# Altium project 1812A_Ticketing.PrjPcb
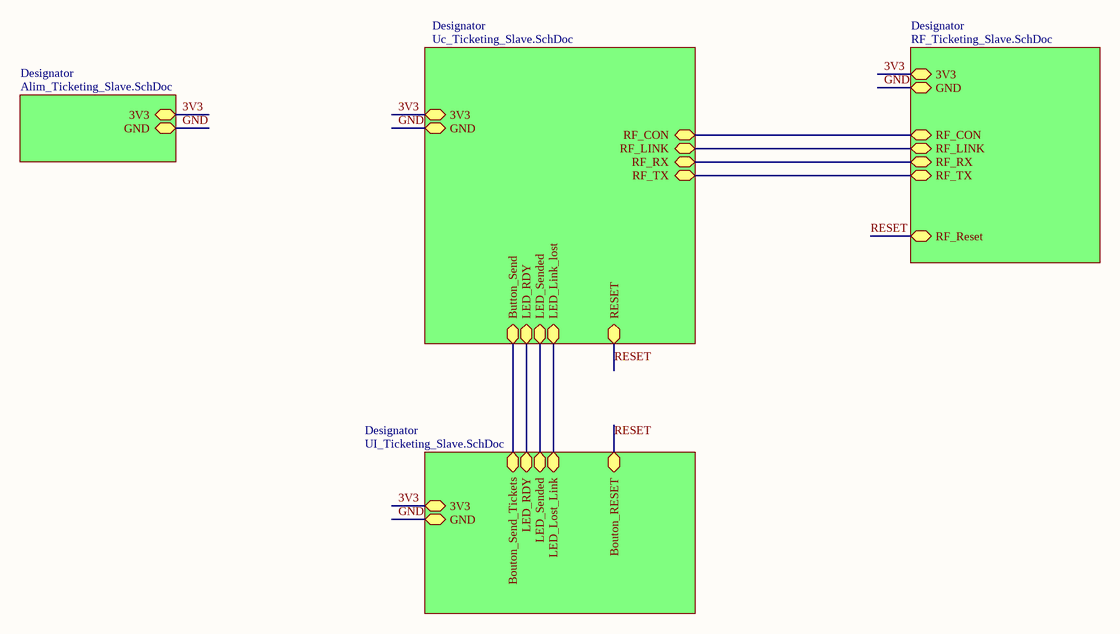
[diagram p0: Ticketing_Slave.SchDoc]
5 sheets, 34 parts. Net scope: hierarchical (ports join the sheet entries above them; power ports are global).
Sheets:
  Ticketing_Slave.SchDoc
    Designator = Uc_Ticketing_Slave.SchDoc
    Designator = RF_Ticketing_Slave.SchDoc
    Designator = UI_Ticketing_Slave.SchDoc
    Designator = Alim_Ticketing_Slave.SchDoc

## Sheet Ticketing_Slave.SchDoc
size A4; Organization: ETML-ES; Address1: Avenue Recordon 1; Address2: 1004 Lausanne; Address3: Switzerland

### Sub-sheets
Designator = Uc_Ticketing_Slave.SchDoc: 3V3, GND, RF_CON, RF_LINK, RF_RX, RF_TX, Button_Send, LED_Link_lost, LED_Sended, LED_RDY, RESET
Designator = RF_Ticketing_Slave.SchDoc: GND, RF_Reset, RF_CON, 3V3, RF_LINK, RF_RX, RF_TX
Designator = UI_Ticketing_Slave.SchDoc: 3V3, GND, Bouton_RESET, LED_RDY, LED_Sended, LED_Lost_Link, Bouton_Send_Tickets
Designator = Alim_Ticketing_Slave.SchDoc: GND, 3V3

### Nets
3V3: sheet Designator/3V3, sheet Designator/3V3, sheet Designator/3V3, sheet Designator/3V3
GND: sheet Designator/GND, sheet Designator/GND, sheet Designator/GND, sheet Designator/GND
Connect(M): sheet Designator/RF_CON, sheet Designator/RF_CON
LED_Lost: sheet Designator/LED_Link_lost, sheet Designator/LED_Lost_Link
LED_Ques: sheet Designator/LED_RDY, sheet Designator/LED_RDY
LED_Send: sheet Designator/LED_Sended, sheet Designator/LED_Sended
LINK(M): sheet Designator/RF_LINK, sheet Designator/RF_LINK
RESET: sheet Designator/RESET, sheet Designator/RF_Reset, sheet Designator/Bouton_RESET
UART_RX: sheet Designator/RF_RX, sheet Designator/RF_RX
UART_TX: sheet Designator/RF_TX, sheet Designator/RF_TX
NetR7_1: sheet Designator/Button_Send, sheet Designator/Bouton_Send_Tickets

### Notes on the sheet
- Fichier :
- Date :
- Heure :
- Projet :
- Auteur :
- Version :
- Chemin :

## Sheet Uc_Ticketing_Slave.SchDoc
size A4; Organization: ETML-ES; Address1: Avenue Recordon 1; Address2: 1004 Lausanne; Address3: Switzerland
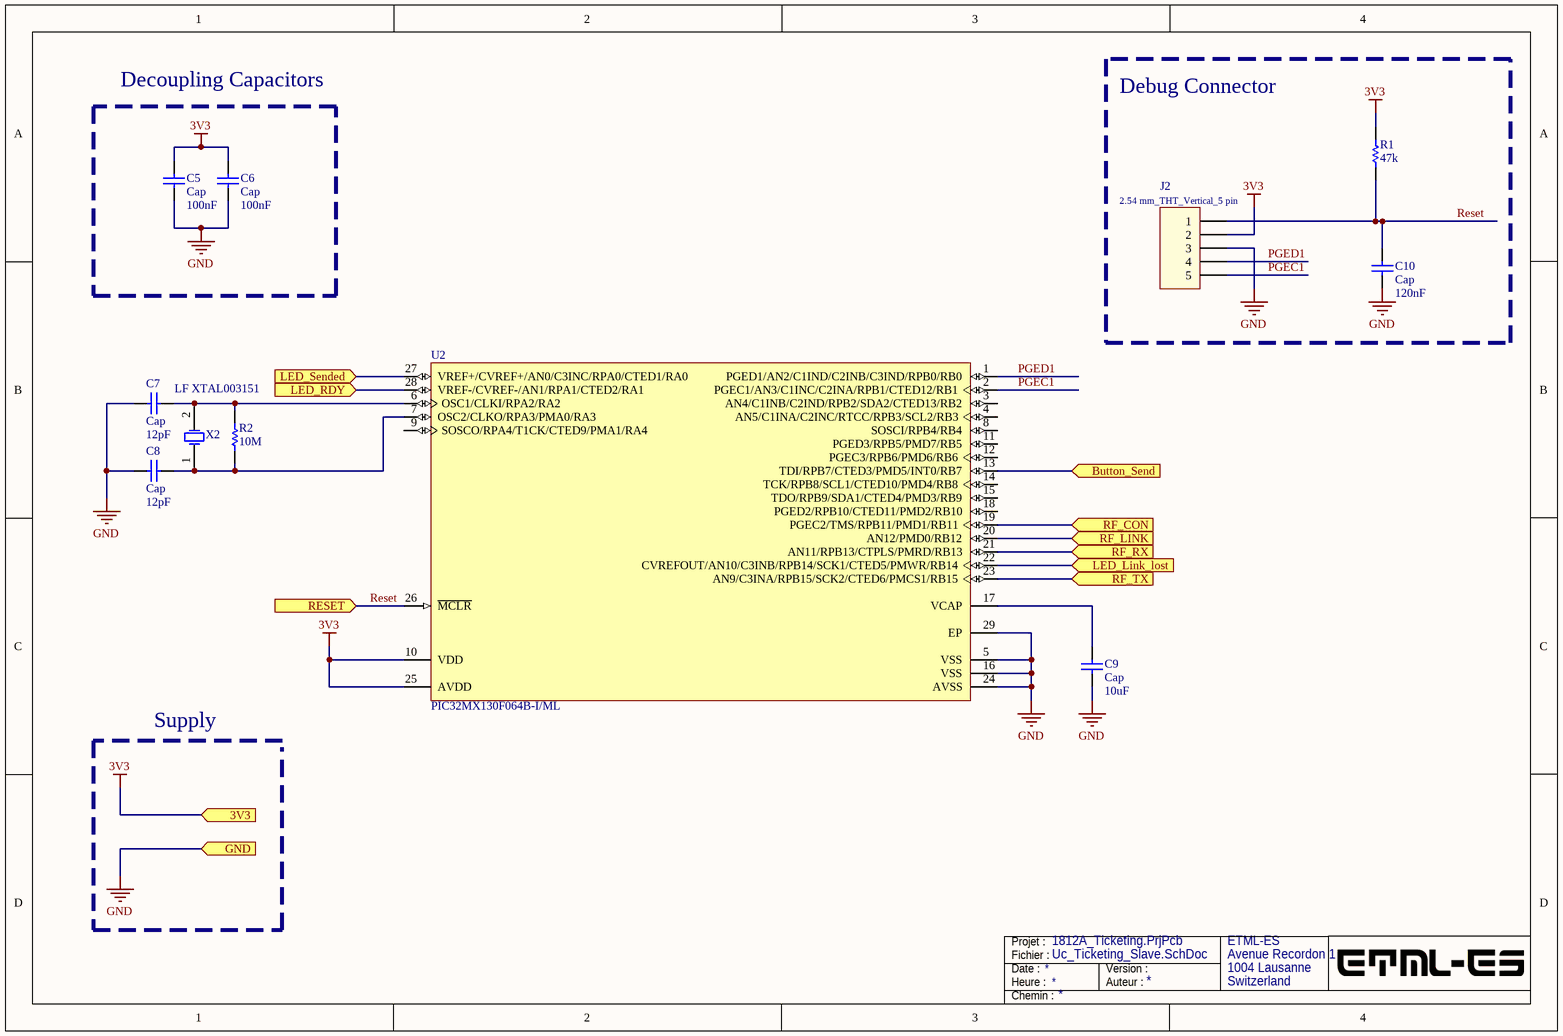
[diagram p1: Uc_Ticketing_Slave.SchDoc]

### Parts
C5  Cap  value 100nF  [6-0805_N]
C6  Cap  value 100nF  [6-0805_N]
C7  Cap  value 12pF  [6-0805_N]
C8  Cap  value 12pF  [6-0805_N]
C9  Cap  value 10uF  [6-0805_N]
C10  Cap  value 120nF  [6-0805_N]
J2  2.54 mm_THT_Vertical_5 pin  [61300511121]
R1  47k  [RESC0805(2012)_L]
R2  10M  [RESC0805(2012)_L]
U2  PIC32MX130F064B-I/ML  [MCHP-QFN-ML28_L]
X2  LF XTAL003151  [ECS-80-18-5PX-TR_V]

### Blocks framed on the sheet
Debug Connector: C10 J2 R1
Decoupling Capacitors: C5 C6

### Ports
3V3, Button_Send, GND, LED_Link_lost, LED_RDY, LED_Sended, RESET, RF_CON, RF_LINK, RF_RX, RF_TX

### Nets
3V3: C5.2 C6.2 J2.2 R1.1 U2.10(VDD) U2.25(AVDD) ; port 3V3
GND: C5.1 C6.1 C7.1 C8.2 C9.1 C10.1 J2.3 U2.5(VSS) U2.16(VSS) U2.24(AVSS) U2.29(EP) ; port GND
Connect(M): U2.19(PGEC2/TMS/RPB11/PMD1/RB11) ; port RF_CON
LED_Lost: U2.22(CVREFOUT/AN10/C3INB/RPB14/SCK1/CTED5/PMWR/RB14) ; port LED_Link_lost
LED_Ques: U2.28(VREF-/CVREF-/AN1/RPA1/CTED2/RA1) ; port LED_RDY
LED_Send: U2.27(VREF+/CVREF+/AN0/C3INC/RPA0/CTED1/RA0) ; port LED_Sended
LINK(M): U2.20(AN12/PMD0/RB12) ; port RF_LINK
PGEC1: J2.5 U2.2(PGEC1/AN3/C1INC/C2INA/RPB1/CTED12/RB1)
PGED1: J2.4 U2.1(PGED1/AN2/C1IND/C2INB/C3IND/RPB0/RB0)
RESET: C10.2 J2.1 R1.2 U2.26(~{MCLR}) ; port RESET
UART_RX: U2.21(AN11/RPB13/CTPLS/PMRD/RB13) ; port RF_RX
UART_TX: U2.23(AN9/C3INA/RPB15/SCK2/CTED6/PMCS1/RB15) ; port RF_TX
NetC7_2: C7.2 R2.2 U2.6(OSC1/CLKI/RPA2/RA2) X2.2(X2)
NetC8_1: C8.1 R2.1 U2.7(OSC2/CLKO/RPA3/PMA0/RA3) X2.1(X1)
NetC9_2: C9.2 U2.17(VCAP)
NetR7_1: U2.13(TDI/RPB7/CTED3/PMD5/INT0/RB7) ; port Button_Send

Not connected (* = marked no-connect by the designer): U2 3(AN4/C1INB/C2IND/RPB2/SDA2/CTED13/RB2) 4(AN5/C1INA/C2INC/RTCC/RPB3/SCL2/RB3) 8(SOSCI/RPB4/RB4) 9(SOSCO/RPA4/T1CK/CTED9/PMA1/RA4) 11(PGED3/RPB5/PMD7/RB5) 12(PGEC3/RPB6/PMD6/RB6) 14(TCK/RPB8/SCL1/CTED10/PMD4/RB8) 15(TDO/RPB9/SDA1/CTED4/PMD3/RB9) 18(PGED2/RPB10/CTED11/PMD2/RB10)

### Notes on the sheet
- Supply
- Fichier :
- Date :
- Heure :
- Projet :
- Auteur :
- Version :
- Chemin :

### Library data of the parts
C5-C10 = Cap: Capacitor; Published: 8-Jun-2000; LatestRevisionDate: 17-Jul-2002; LatestRevisionNote: Re-released for DXP Platform.; PackageReference: RAD-0.3; Publisher: Altium Limited; PackageDescription: Radial Cap, Thru-Hole; 2 Leads; 0.3 in Pin Spacing
J2 = 61300511121: Pin Header WR-PHD, pitch 2.54 mm, THT, Vertical, single row, 5 pin; Rated Current: 3 A; Pin Number: 5; Pitch: 2.54 mm; Working Voltage: 250 VAC; Contact Resistance: 20 mOhm; Insulation Resistance: >1000 MOhm; ComponentLink1Description: Manufacturer; ComponentLink1URL: http://www.we-online.de; ComponentLink2Description: Datasheet; ComponentLink2URL: http://katalog.we-online.de/em/datasheet/6130xx11121.pdf; Part Number: 61300511121; Published Date: Jan. 2018; Publisher: Wurth Elektronik; Operating Temperature: -40 to 105 degC; Mounting Technology: THT; Row Number: Single; Orientation: Vertical
R1 = CMP-1013-00122-1: 100K 0.125W 5% 0805 (2012 Metric)  SMD; Case-Metric: 2012; Case-EIA: 0805; Tolerance: 5 %; Technology: SMT; Value: 47k; Power: 0.125 W
R2 = CMP-1013-00122-1: 100K 0.125W 5% 0805 (2012 Metric)  SMD; Case-Metric: 2012; Value: 47k; Case-EIA: 0805; Tolerance: 5 %; Technology: SMT; Power: 0.125 W
U2 = CMP-0048-00437-1: 32-bit Microcontroller with Audio and Graphics Interface, USB and Advanced Analog, 40 MHz, 21 I/O, PMP, -40 to 85 degC, 28-pin QFN (ML28), Tube; Manufacturer: Microchip; PackageReference: QFN-ML28; ComponentLink1URL: http://www.microchip.com; ComponentLink2URL: http://ww1.microchip.com/downloads/en/DeviceDoc/61168E.pdf; PartNumber: PIC32MX130F064B-I/ML; ComponentLink3URL: http://www.microchip.com/stellent/groups/techpub_sg/documents/packagingspec/en012702.pdf; ComponentLink4Description: Product URL; PackageVersion: C04-105C; PackageDescription: 28-Lead Plastic Quad Flat, 6 x 6 mm Body, 0.65 mm Pitch; Mounting Technology: Surface Mount; ComponentLink3Description: Package Specification; ComponentLink2Description: Datasheet; DatasheetVersion: Rev. E; ComponentLink1Description: Manufacturer URL; ComponentLink4URL: http://www.microchip.com/PIC32MX130F064B
X2 = CMP-2000-06193-1: Low Profile Quartz Crystal, 8.0 MHz, 2-Pin SMD, RoHS, Tape and Reel; Brand: ECS; Tolerance: 30PPM; Case Height: 4.3mm; Frequency: 8MHz; Frequency Stability: 50PPM; Case Length: 13.2mm; Case Width: 4.8mm; Load Capacitance: 18pF; Termination Style: SMD/SMT; Product Category: Crystals; Packaging: Reel; Package Reference: ECS-80-18-5PX-TR; Mounting Technology: SurfaceMount; Dimensions: 4.8mmWx13.2mmLx4.3mmH; Package Description: 2-Pin Surface Mount Device, Body 11.4 x 4.8 mm, Height 4.3 mm; Datasheet URL: https://www.ecsxtal.com/store/pdf/csm-7x.pdf; Datasheet Version: 05/2016; Manufacturer: ECS; Factory Pack Quantity: 1000; Manufacturer URL: https://www.ecsxtal.com/; Type: SMDQuartzCrystals; Mounting Style: SMD/SMT; Package / Case: HC-49/US; Operating Temperature Range: -10Cto+70C; RoHS: Details; Series: CSM-7X

## Sheet RF_Ticketing_Slave.SchDoc
size A4; Organization: ETML-ES; Address1: Avenue Recordon 1; Address2: 1004 Lausanne; Address3: Switzerland
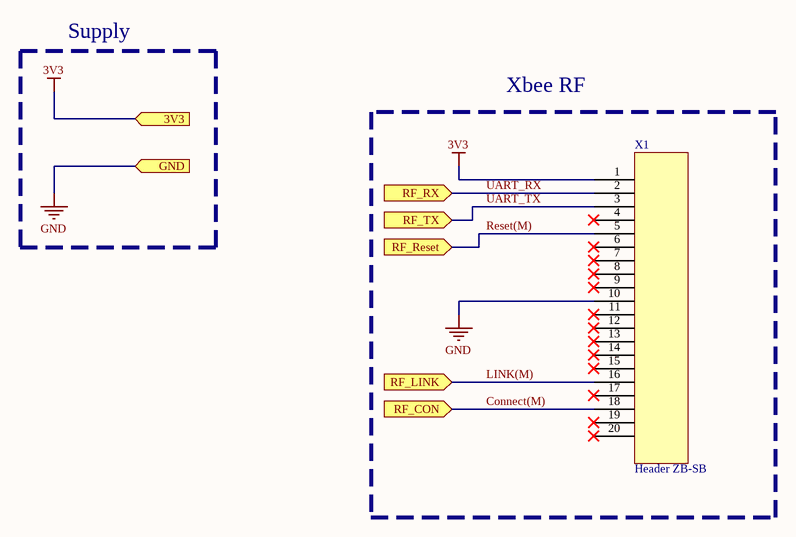
[diagram p2: RF_Ticketing_Slave.SchDoc]

### Parts
X1  Header ZB-SB  [ZB-SB]

### Blocks framed on the sheet
Xbee RF: X1

### Ports
3V3, GND, RF_CON, RF_LINK, RF_Reset, RF_RX, RF_TX

### Nets
3V3: X1.1 ; port 3V3
GND: X1.10 ; port GND
Connect(M): X1.18 ; port RF_CON
LINK(M): X1.16 ; port RF_LINK
Reset(M): X1.5 ; port RF_Reset  [project net RESET]
UART_RX: X1.2 ; port RF_RX
UART_TX: X1.3 ; port RF_TX

Not connected (* = marked no-connect by the designer): X1 4* 6* 7* 8* 9* 11* 12* 13* 14* 15* 17* 19* 20*

### Notes on the sheet
- Supply
- Fichier :
- Date :
- Heure :
- Projet :
- Auteur :
- Version :
- Chemin :

### Library data of the parts
X1 = HDR ZB-SB 2x10: Header 2x10; PackageCase: XBee; Value: 2x10

## Sheet UI_Ticketing_Slave.SchDoc
size A4; Organization: ETML-ES; Address1: Avenue Recordon 1; Address2: 1004 Lausanne; Address3: Switzerland
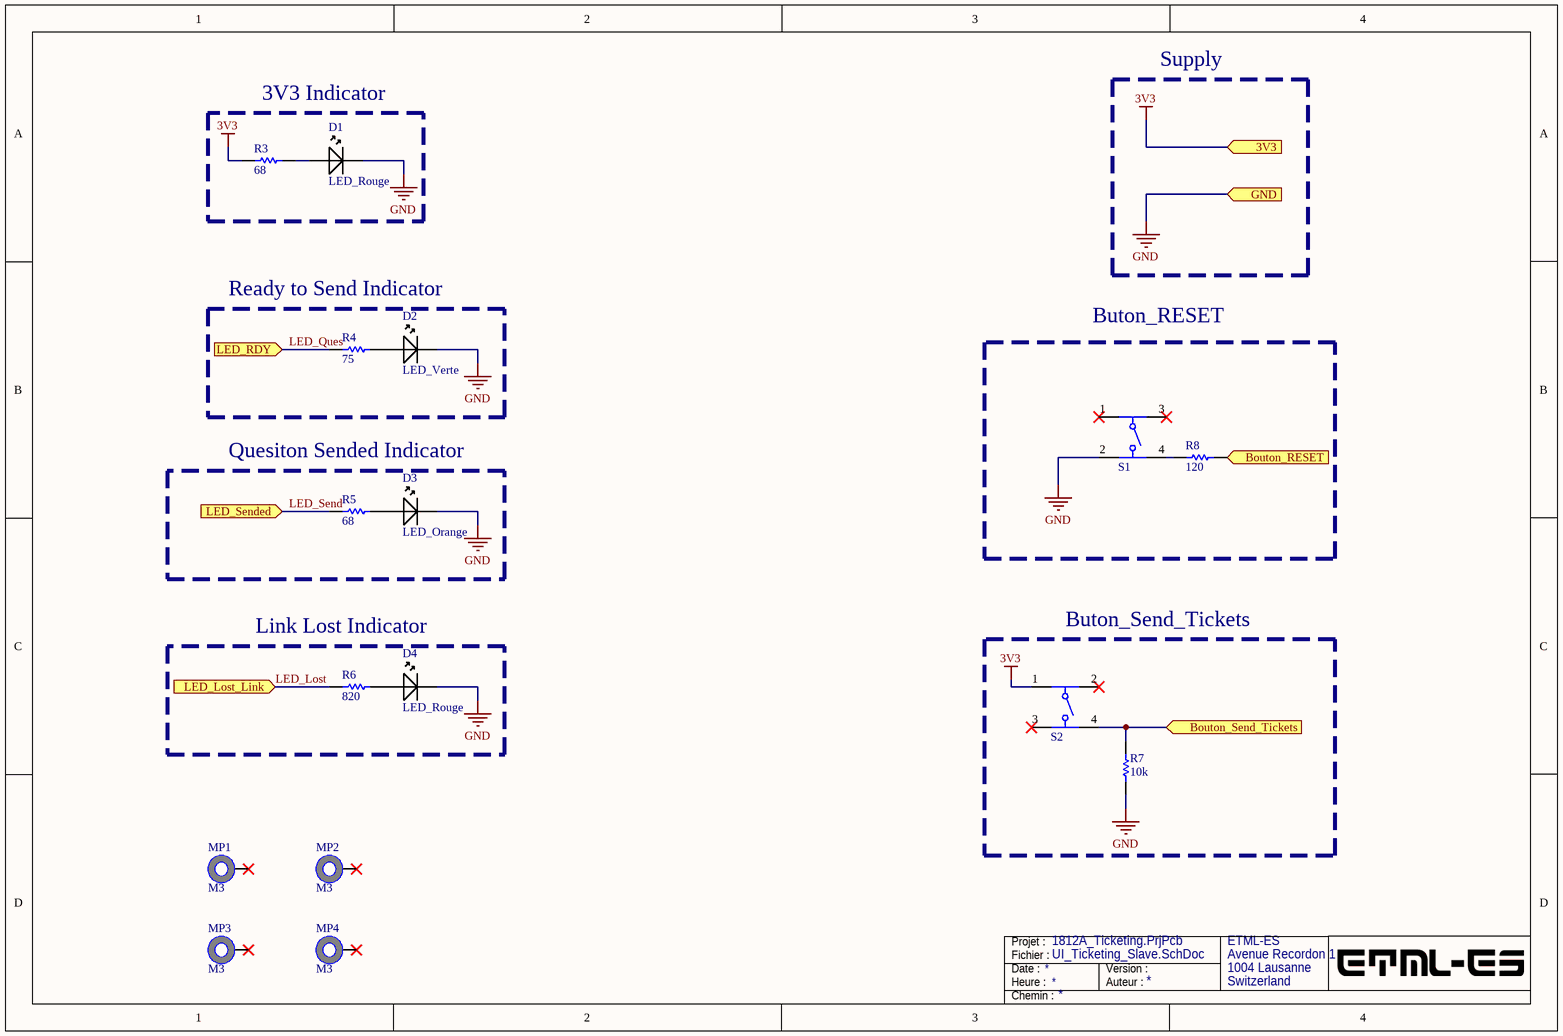
[diagram p3: UI_Ticketing_Slave.SchDoc]

### Parts
D1  LED_Rouge  [LED-2P-2.28-3MM]
D2  LED_Verte  [Type 5mm]
D3  LED_Orange  [Type 5mm]
D4  LED_Rouge  [Type 5mm]
MP1  M3  [9774010151]
MP2  M3  [9774010151]
MP3  M3  [9774010151]
MP4  M3  [9774010151]
R3  68  [RESC0805(2012)_L]
R4  75  [RESC0805(2012)_L]
R5  68  [RESC0805(2012)_L]
R6  820  [RESC0805(2012)_L]
R7  10k  [RESC0805(2012)_L]
R8  120  [RESC0805(2012)_L]
S1  430182050816  [430182050816]  (value not drawn)
S2  430466073726  [4304x60737x6_12x12x7.3]  (value not drawn)

### Blocks framed on the sheet
3V3 Indicator: D1 R3
Ready to Send Indicator: D2 R4
Buton_RESET: R8 S1
Quesiton Sended Indicator: D3 R5
Link Lost Indicator: D4 R6
Buton_Send_Tickets: R7 S2

### Ports
3V3, Bouton_RESET, Bouton_Send_Tickets, GND, LED_Lost_Link, LED_RDY, LED_Sended

### Nets
3V3: R3.2 S2.1 ; port 3V3
GND: D1.2(Cathode) D2.1(Cathode) D3.1(Cathode) D4.1(Cathode) R7.2 S1.2 ; port GND
LED_Lost: R6.2 ; port LED_Lost_Link
LED_Ques: R4.2 ; port LED_RDY
LED_Send: R5.2 ; port LED_Sended
RESET: R8.2 ; port Bouton_RESET
NetD1_1: D1.1(Anode) R3.1
NetD2_2: D2.2(Anode) R4.1
NetD3_2: D3.2(Anode) R5.1
NetD4_2: D4.2(Anode) R6.1
NetR7_1: R7.1 S2.4 ; port Bouton_Send_Tickets
NetR8_1: R8.1 S1.4

Not connected (* = marked no-connect by the designer): MP1 1*; MP2 1*; MP3 1*; MP4 1*; S1 1* 3*; S2 2* 3*

### Notes on the sheet
- Supply
- Fichier :
- Date :
- Heure :
- Projet :
- Auteur :
- Version :
- Chemin :

### Library data of the parts
D1-D4 = LED: Supplier A: *; Supplier B: *; Supplier B Ref: *; Manufacturer URL: *; Manufacturer Ref: *; Package: *
  D1: Supplier A Ref: 754-1305-ND
  D2: Supplier A Ref: 754-1265-ND
  D3: Supplier A Ref: 754-1896-ND
  D4: Supplier A Ref: 754-1266-ND
MP1-MP4 = 9774010151: WA-SMSI SMT Steel Spacer, M2.5 Thread Internal, Length 1mm; InnerDiameter: 3.5mm; OuterDiameter: 5.1mm; PublishedDate: Dec. 2016; Publisher: Wurth Elektronik; ComponentLink1Description: Manufacturer; ComponentLink1URL: http://www.we-online.de; ComponentLink2Description: Datasheet; ComponentLink2URL: http://katalog.we-online.de/em/datasheet/9774010151.pdf; PartNumber: 9774010151; Length: 1mm; Thread: M2.5; Packaging: Bulk
R3 R4 R7 = CMP-1013-00122-1: as R1 on sheet Uc_Ticketing_Slave; Tolerance: 5 %; Technology: SMT; Power: 0.125 W
  R3: Value: 68
  R4: Value: 75
  R7: Value: 10k
R5 R6 = CMP-1013-00122-1: 100K 0.125W 5% 0805 (2012 Metric)  SMD; Case-Metric: 2012; Value: 680; Case-EIA: 0805; Tolerance: 5 %; Technology: SMT; Power: 0.125 W
R8 = CMP-1013-00122-1: 100K 0.125W 5% 0805 (2012 Metric)  SMD; Case-Metric: 2012; Value: 10k; Case-EIA: 0805; Tolerance: 5 %; Technology: SMT; Power: 0.125 W
S1 = 430182050816: 6x6mm SMD Tact Switch WS-TASV, height 5 mm, 160 gf; Rated Current: 50 mA; Operation Force: 160 gf; Rated Voltage: 12 VDC; ComponentLink1Description: Manufacturer; ComponentLink1URL: http://www.we-online.de; ComponentLink2Description: Datasheet; ComponentLink2URL: http://katalog.we-online.de/em/datasheet/4301x2xxx8x6.pdf; Part Number: 430182050816; Published Date: Nov. 2017; Publisher: Wurth Elektronik; Life Cycle: 1000000; Operating Temperature: -40 to +85 degC; Size: 6x6x5 mm
S2 = 430466073726: WS-TATV 12x12mm washable Tact Switch, THT version; Operation Force: 260g; ComponentLink1Description: Manufacturer; ComponentLink1URL: http://www.we-online.de; ComponentLink2Description: Datasheet; ComponentLink2URL: http://katalog.we-online.de/em/datasheet/4304x60737x6.pdf; Part Number: 430466073726; Published Date: June 2017; Publisher: Wurth Elektronik; Size: 12x12x7.3 mm; Life Cycle: 300000 cycles

## Sheet Alim_Ticketing_Slave.SchDoc
size A4; Organization: ETML-ES; Address1: Avenue Recordon 1; Address2: 1004 Lausanne; Address3: Switzerland
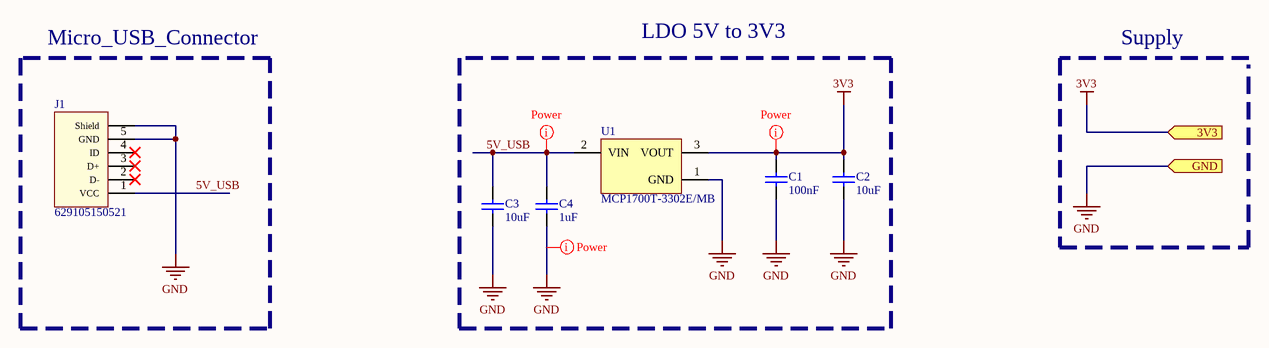
[diagram p4: Alim_Ticketing_Slave.SchDoc]

### Parts
C1  100nF  [6-0805_N]
C2  10uF  [6-0805_N]
C3  10uF  [6-0805_N]
C4  1uF  [6-0805_N]
J1  629105150521  [629105150521]
U1  MCP1700T-3302E/MB  [SOT-89-MB3_M]

### Blocks framed on the sheet
Micro_USB_Connector: J1
LDO 5V to 3V3: C1-C4 U1

### Ports
3V3, GND

### Nets
3V3: C1.2 C2.2 U1.3(VOUT) ; port 3V3
GND: C1.1 C2.1 C3.1 C4.1 J1.5(GND) J1.Shell(Shield) U1.1(GND) ; port GND
5V_USB: C3.2 C4.2 J1.1(VCC) U1.2(VIN)

Not connected (* = marked no-connect by the designer): J1 2(D-)* 3(D+)* 4(ID)*

### Layout directives
net class Power: 5V_USB
net class Undefined: 3V3, GND

### Notes on the sheet
- Supply
- Fichier :
- Date :
- Heure :
- Projet :
- Auteur :
- Version :
- Chemin :

### Library data of the parts
C1 = CMP-1036-04401-1: CAP 100nF 16V ±10% 0805 (2012 Metric) Thickness 1.45mm SMD; Case-Metric: 2012; Case-EIA: 0805; Tolerance: Â±10%; Max Thickness: 1.45 mm; Technology: SMT; Value: 100nF; Rated Voltage: 16 V
C2-C4 = CMP-1036-04930-1: CAP 10uF 16V ±20% 0805 (2012 Metric) Thickness 1mm SMD; Case-Metric: 2012; Case-EIA: 0805; Tolerance: Â±20%; Value: 10uF; Rated Voltage: 16 V; Technology: SMT; Max Thickness: 1 mm
J1 = 629105150521: Micro USB 2.0 SMT Type B Horizontal 5 Contacts High Current WR-COM; Interface Type: Type B; Gender: Receptacle; ComponentLink1Description: Manufacturer; ComponentLink1URL: http://www.we-online.de; ComponentLink2Description: Datasheet; ComponentLink2URL: http://katalog.we-online.de/em/datasheet/629105150521.pdf; Part Number: 629105150521; Published Date: April 2017; Publisher: Wurth Elektronik; Sub-Family: Micro USB 2.0; Type: Horizontal; Construction: SMT
U1 = CMP-0136-00812-1: Low Quiescent Current LDO, 3-Pin SOT-89, Extended Temperature, Tape and Reel; PackageDescription: 3-Lead Plastic Small Outline Transistor Header (MB) [SOT-89]; PackageReference: SOT-89-MB3; DatasheetVersion: revB, Feb-2007; Code_IPC: SOT89; PackageVersion: revBB, Aug-2009

## Nets that join several sheets
3V3: Uc_Ticketing_Slave (6 pins), RF_Ticketing_Slave (X1.1), UI_Ticketing_Slave (R3.2 S2.1), Alim_Ticketing_Slave (C1.2 C2.2 U1.3)
GND: Uc_Ticketing_Slave (11 pins), RF_Ticketing_Slave (X1.10), UI_Ticketing_Slave (6 pins), Alim_Ticketing_Slave (7 pins)
Connect(M): Uc_Ticketing_Slave (U2.19), RF_Ticketing_Slave (X1.18)
LED_Lost: Uc_Ticketing_Slave (U2.22), UI_Ticketing_Slave (R6.2)
LED_Ques: Uc_Ticketing_Slave (U2.28), UI_Ticketing_Slave (R4.2)
LED_Send: Uc_Ticketing_Slave (U2.27), UI_Ticketing_Slave (R5.2)
LINK(M): Uc_Ticketing_Slave (U2.20), RF_Ticketing_Slave (X1.16)
NetR7_1: Uc_Ticketing_Slave (U2.13), UI_Ticketing_Slave (R7.1 S2.4)
RESET: Uc_Ticketing_Slave (C10.2 J2.1 R1.2 U2.26), RF_Ticketing_Slave (X1.5), UI_Ticketing_Slave (R8.2)
UART_RX: Uc_Ticketing_Slave (U2.21), RF_Ticketing_Slave (X1.2)
UART_TX: Uc_Ticketing_Slave (U2.23), RF_Ticketing_Slave (X1.3)